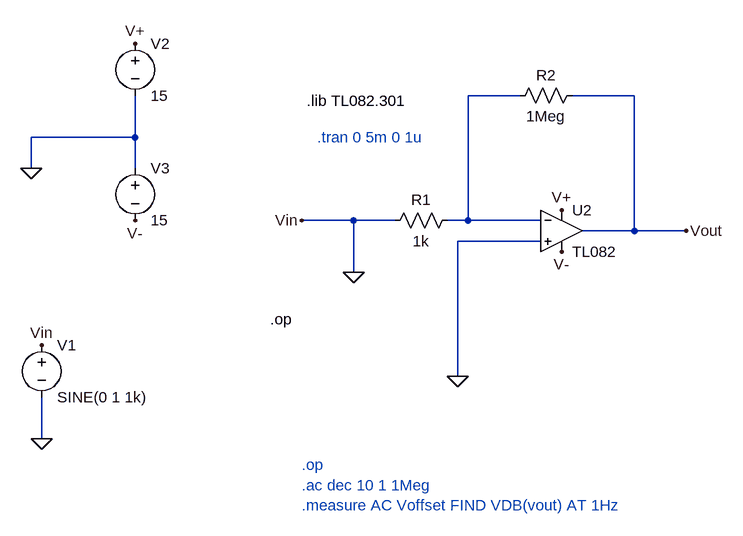
[diagram p0: schematic test-input-offset-voltage-tl802-op-amp.asc]
test-input-offset-voltage-tl802-op-amp.asc, the LTspice schematic file:
Version 4
SHEET 1 1576 900
WIRE 32 -192 -48 -192
WIRE 208 -192 112 -192
WIRE -560 -128 -560 -192
WIRE -560 -128 -720 -128
WIRE -720 -80 -720 -128
WIRE -560 -80 -560 -128
WIRE -224 0 -304 0
WIRE -160 0 -224 0
WIRE -48 0 -48 -192
WIRE -48 0 -80 0
WIRE 64 0 -48 0
WIRE 208 16 208 -192
WIRE 208 16 128 16
WIRE 288 16 208 16
WIRE 64 32 -64 32
WIRE -224 80 -224 0
WIRE -64 240 -64 32
WIRE -704 336 -704 272
FLAG 288 16 Vout
FLAG -304 0 Vin
FLAG -704 336 0
FLAG -704 192 Vin
FLAG -720 -80 0
FLAG -560 0 V-
FLAG -560 -272 V+
FLAG 96 48 V-
FLAG 96 -16 V+
FLAG -64 240 0
FLAG -224 80 0
SYMBOL voltage -704 176 R0
SYMATTR InstName V1
SYMATTR Value SINE(0 1 1k)
SYMBOL OpAmps/opamp2 96 -48 R0
SYMATTR InstName U2
SYMATTR Value TL082
SYMBOL Voltage -560 -288 R0
SYMATTR InstName V2
SYMATTR Value 15
SYMBOL Voltage -560 -96 R0
SYMATTR InstName V3
SYMATTR Value 15
SYMBOL Res -64 -16 R90
WINDOW 0 0 56 VBottom 2
WINDOW 3 32 56 VTop 2
SYMATTR InstName R1
SYMATTR Value 1k
SYMBOL Res 128 -208 R90
WINDOW 0 0 56 VBottom 2
WINDOW 3 32 56 VTop 2
SYMATTR InstName R2
SYMATTR Value 1Meg
TEXT -296 -184 Left 2 !.lib TL082.301
TEXT -280 -128 Left 2 ;.tran 0 5m 0 1u
TEXT -304 376 Left 2 ;.op\n.ac dec 10 1 1Meg\n.measure AC Voffset FIND VDB(vout) AT 1Hz
TEXT -352 152 Left 2 !.op

The netlist it stands for:
* test-input-offset-voltage-tl802-op-amp.asc
V1 0 0 SINE(0 1 1k)
XU2 0 N001 V+ V- Vout TL082  ; pins In+ In- V+ V- OUT
V2 V+ 0 15
V3 0 V- 15
R1 N001 0 1k
R2 Vout N001 1Meg
.lib TL082.301
* .tran 0 5m 0 1u
* .op
* .ac dec 10 1 1Meg
* .measure AC Voffset FIND VDB(vout) AT 1Hz
.op
.backanno
.end